# Altium schematic sheet Strain gauge.SchDoc
size 153 x 118 mm; Origin: Eagle
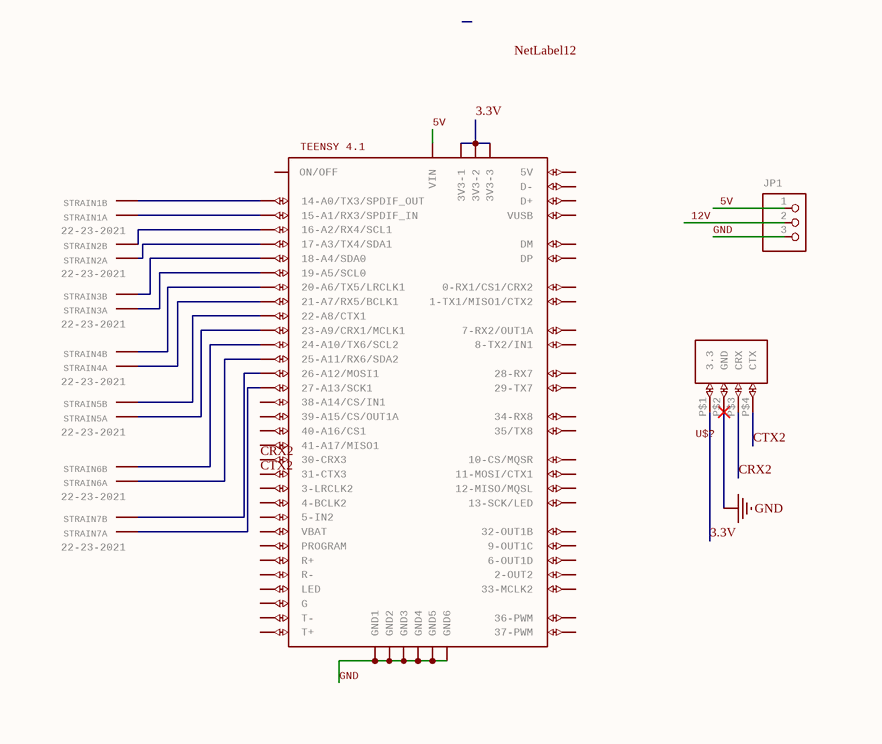
[diagram p0: Strain gauge.SchDoc]

## Parts
JP1  (no value)  [1X03]
STRAIN1  22-23-2021  [22-23-2021]  (parts A,B of 2)
STRAIN2  22-23-2021  [22-23-2021]  (parts A,B of 2)
STRAIN3  22-23-2021  [22-23-2021]  (parts A,B of 2)
STRAIN4  22-23-2021  [22-23-2021]  (parts A,B of 2)
STRAIN5  22-23-2021  [22-23-2021]  (parts A,B of 2)
STRAIN6  22-23-2021  [22-23-2021]  (parts A,B of 2)
STRAIN7  22-23-2021  [22-23-2021]  (parts A,B of 2)
U$1  TEENSY4.1: TEENSY 4.1  [TEENSY41]
U$?  CAN_TEE  [CAN_TEN]  (value not drawn)

## Nets
GND: JP1.3 U$1.GND1 U$1.GND2 U$1.GND3 U$1.GND4 U$1.GND5 U$1.GND6 U$?.P$2(GND)
3.3V: U$1.3V3-1 U$1.3V3-2 U$1.3V3-3 U$?.P$1(3.3)
5V: JP1.1 U$1.VIN
12V: JP1.2
CRX2: U$1.30-CRX3 U$?.P$3(CRX)
CTX2: U$1.31-CTX3 U$?.P$4(CTX)
NetSTRAIN1_1: STRAIN1.1(S) U$1.15-A1/RX3/SPDIF_IN
NetSTRAIN1_2: STRAIN1.2(S) U$1.14-A0/TX3/SPDIF_OUT
NetSTRAIN2_1: STRAIN2.1(S) U$1.17-A3/TX4/SDA1
NetSTRAIN2_2: STRAIN2.2(S) U$1.16-A2/RX4/SCL1
NetSTRAIN3_1: STRAIN3.1(S) U$1.19-A5/SCL0
NetSTRAIN3_2: STRAIN3.2(S) U$1.18-A4/SDA0
NetSTRAIN4_1: STRAIN4.1(S) U$1.21-A7/RX5/BCLK1
NetSTRAIN4_2: STRAIN4.2(S) U$1.20-A6/TX5/LRCLK1
NetSTRAIN5_1: STRAIN5.1(S) U$1.23-A9/CRX1/MCLK1
NetSTRAIN5_2: STRAIN5.2(S) U$1.22-A8/CTX1
NetSTRAIN6_1: STRAIN6.1(S) U$1.25-A11/RX6/SDA2
NetSTRAIN6_2: STRAIN6.2(S) U$1.24-A10/TX6/SCL2
NetSTRAIN7_1: STRAIN7.1(S) U$1.27-A13/SCK1
NetSTRAIN7_2: STRAIN7.2(S) U$1.26-A12/MOSI1

Not connected (* = marked no-connect by the designer): U$1 0-RX1/CS1/CRX2 1-TX1/MISO1/CTX2 2-OUT2 3-LRCLK2 4-BCLK2 5-IN2 6-OUT1D 7-RX2/OUT1A 8-TX2/IN2(8-TX2/IN1) 9-OUT1C 10-CS\MQSR(10-CS/MQSR) 11-MOSI/CTX1 12-MISO/MQSL 13-SCK/LED 28-RX7 29-TX7 32-OUT1B 33-MCLK2 34-RX8 35-TX8(35/TX8) 36-PWM 37-PWM 38-A14/CS/IN1 39-A15/CS/OUT1A 40-A16/CS1 41-A17/MISO1 +5V(5V) D+ D- DM DP G LED ON/OFF PROGRAM R+ R- T+ T- VBAT VUSB

## Notes on the sheet
- Labels drawn without touching a wire or pin: NetLabel12

## Library data of the parts
JP1 = PINHD-1X3: PIN HEADER; GateName_1: A; SymbolName_1: PINHD3; LibraryName: adafruit; DeviceSetName: PINHD-1X3
STRAIN1-STRAIN7 = 22-23-2021: .100" (2.54mm) Center Header - 2 Pin; GateName_1: -1; SymbolName_1: MV; GateName_2: -2; SymbolName_2: M; MF: MOLEX; POPULARITY: 40; LibraryName: con-molex; DeviceSetName: 22-23-2021; MPN: 22-23-2021; OC_FARNELL: 1462926; OC_NEWARK: 25C3832
U$1 = TEENSY41: GateName_1: G$1; SymbolName_1: TEENSY41; LibraryName: teensy; DeviceSetName: TEENSY41
U$? = CAN_TEE: GateName_1: G$1; SymbolName_1: CAN_TEN; LibraryName: F-E library custom components; DeviceSetName: CAN_TEE